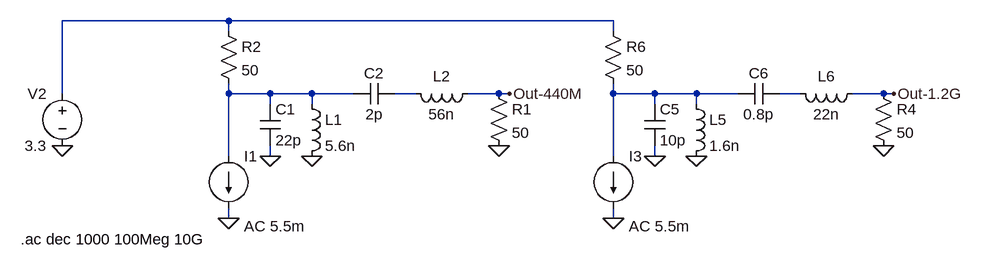
[diagram p0: schematic RFFilters.asc]
RFFilters.asc, the LTspice schematic file:
Version 4
SHEET 1 1956 680
WIRE 240 32 -16 32
WIRE 832 32 240 32
WIRE 240 48 240 32
WIRE 832 48 832 32
WIRE -16 144 -16 32
WIRE 240 144 240 128
WIRE 304 144 240 144
WIRE 368 144 304 144
WIRE 432 144 368 144
WIRE 528 144 496 144
WIRE 656 144 608 144
WIRE 672 144 656 144
WIRE 832 144 832 128
WIRE 896 144 832 144
WIRE 960 144 896 144
WIRE 1024 144 960 144
WIRE 1120 144 1088 144
WIRE 1248 144 1200 144
WIRE 1264 144 1248 144
WIRE 304 160 304 144
WIRE 368 160 368 144
WIRE 896 160 896 144
WIRE 960 160 960 144
WIRE 240 240 240 144
WIRE 304 240 304 224
WIRE 832 240 832 144
WIRE 896 240 896 224
WIRE 240 336 240 320
WIRE 832 336 832 320
FLAG -16 224 0
FLAG 656 224 0
FLAG 240 336 0
FLAG 672 144 Out-440M
FLAG 368 240 0
FLAG 304 240 0
FLAG 1248 224 0
FLAG 832 336 0
FLAG 1264 144 Out-1.2G
FLAG 960 240 0
FLAG 896 240 0
SYMBOL voltage -16 128 M0
WINDOW 123 0 0 Left 0
WINDOW 39 24 124 Left 2
SYMATTR InstName V2
SYMATTR Value 3.3
SYMBOL res 640 128 R0
SYMATTR InstName R1
SYMATTR Value 50
SYMBOL current 240 240 R0
WINDOW 123 24 108 Left 2
WINDOW 39 0 0 Left 0
SYMATTR Value2 AC 5.5m
SYMATTR InstName I1
SYMATTR Value ""
SYMBOL res 224 32 R0
SYMATTR InstName R2
SYMATTR Value 50
SYMBOL cap 288 160 R0
SYMATTR InstName C1
SYMATTR Value 22p
SYMBOL ind 352 144 R0
SYMATTR InstName L1
SYMATTR Value 5.6n
SYMBOL cap 496 128 R90
WINDOW 0 0 32 VBottom 2
WINDOW 3 32 32 VTop 2
SYMATTR InstName C2
SYMATTR Value 2p
SYMBOL ind 624 128 R90
WINDOW 0 5 56 VBottom 2
WINDOW 3 32 56 VTop 2
SYMATTR InstName L2
SYMATTR Value 56n
SYMBOL res 1232 128 R0
SYMATTR InstName R4
SYMATTR Value 50
SYMBOL cap 880 160 R0
SYMATTR InstName C5
SYMATTR Value 10p
SYMBOL ind 944 144 R0
SYMATTR InstName L5
SYMATTR Value 1.6n
SYMBOL cap 1088 128 R90
WINDOW 0 0 32 VBottom 2
WINDOW 3 32 32 VTop 2
SYMATTR InstName C6
SYMATTR Value 0.8p
SYMBOL ind 1216 128 R90
WINDOW 0 5 56 VBottom 2
WINDOW 3 32 56 VTop 2
SYMATTR InstName L6
SYMATTR Value 22n
SYMBOL current 832 240 R0
WINDOW 123 24 108 Left 2
WINDOW 39 0 0 Left 0
SYMATTR Value2 AC 5.5m
SYMATTR InstName I3
SYMATTR Value ""
SYMBOL res 816 32 R0
SYMATTR InstName R6
SYMATTR Value 50
TEXT -80 368 Left 2 !.ac dec 1000 100Meg 10G

The netlist it stands for:
* RFFilters.asc
V2 N001 0 3.3
R1 Out-440M 0 50
I1 N002 0 AC 5.5m
R2 N001 N002 50
C1 N002 0 22p
L1 N002 0 5.6n
C2 N003 N002 2p
L2 Out-440M N003 56n
R4 Out-1.2G 0 50
C5 N004 0 10p
L5 N004 0 1.6n
C6 N005 N004 0.8p
L6 Out-1.2G N005 22n
I3 N004 0 AC 5.5m
R6 N001 N004 50
.ac dec 1000 100Meg 10G
.backanno
.end